# Altium project 转接板.PrjPCB
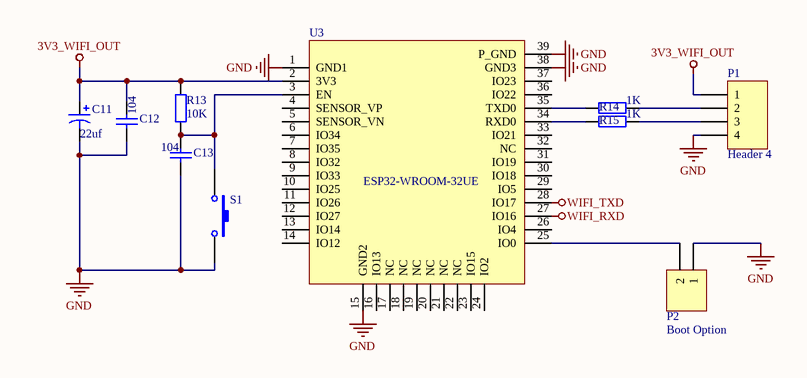
[diagram p0: 转接板.SchDoc]
1 sheet, 10 parts. Net scope: global (net labels, ports and power ports of the same name join across sheets).

## Sheet 转接板.SchDoc
size A0; Organization: Altium Limited; Address1: L3, 12a Rodborough Rd; Address2: Frenchs Forest; Address3: NSW; Address4: Australia 2086

### Parts
C11  value 22uf  [RB7.6-15]  (hidden comment: Cap Pol1)
C12  value 104  [0805-JT]  (hidden comment: Cap)
C13  value 104  [0805-JT]  (hidden comment: Cap)
P1  Header 4  [HDR1X4]
P2  Boot Option  [HDR1X2]
R13  value 10K  [0603-JT]  (hidden comment: Res2)
R14  value 1K  [0603-JT]  (hidden comment: Res2)
R15  value 1K  [0603-JT]  (hidden comment: Res2)
S1  SW-PB  [SPST-2]  (value not drawn)
U3  ESP32-WROOM-32UE  (value not drawn)

### Nets
3V3_WIFI_OUT: C11.1 C12.2 P1.1 R13.1 U3.2(3V3)
GND: C11.2 C12.1 C13.1 P1.4 P2.1 S1.2 U3.1(GND1) U3.15(GND2) U3.38(GND3) U3.39(P_GND)
WIFI_RXD: U3.27(IO16)
WIFI_TXD: U3.28(IO17)
NetC13_2: C13.2 R13.2 S1.1 U3.3(EN)
NetP1_2: P1.2 R14.2
NetP1_3: P1.3 R15.2
NetP2_2: P2.2 U3.25(IO0)
NetR14_1: R14.1 U3.35(TXD0)
NetR15_1: R15.1 U3.34(RXD0)

Not connected (* = marked no-connect by the designer): U3 4(SENSOR_VP) 5(SENSOR_VN) 6(IO34) 7(IO35) 8(IO32) 9(IO33) 10(IO25) 11(IO26) 12(IO27) 13(IO14) 14(IO12) 16(IO13) 17(NC) 18(NC) 19(NC) 20(NC) 21(NC) 22(NC) 23(IO15) 24(IO2) 26(IO4) 29(IO5) 30(IO18) 31(IO19) 32(NC) 33(IO21) 36(IO22) 37(IO23)

### Notes on the sheet
- Title
- Size:
- Date:
- File:
- A0
- Number:
- Time:
- Revision:
- Sheet
- of

### Library data of the parts
C11 = Cap Pol1: Polarized Capacitor (Radial); Published: 8-Jun-2000; LatestRevisionDate: 17-Jul-2002; LatestRevisionNote: Re-released for DXP Platform.; PackageReference: RB7.6-15; Publisher: Altium Limited; PackageDescription: Polarized Capacitor (Radial); 2 Leads
C12 C13 = Cap: Capacitor; Published: 8-Jun-2000; LatestRevisionDate: 17-Jul-2002; LatestRevisionNote: Re-released for DXP Platform.; PackageReference: RAD-0.3; Publisher: Altium Limited; PackageDescription: Radial Cap, Thru-Hole; 2 Leads; 0.3 in Pin Spacing
P1 = Header 4: Header, 4-Pin; LatestRevisionDate: 17-Jul-2002; LatestRevisionNote: Re-released for DXP Platform.; Publisher: Altium Limited
P2 = Header 2: Header, 2-Pin; LatestRevisionDate: 17-Jul-2002; LatestRevisionNote: Re-released for DXP Platform.; Publisher: Altium Limited
R13-R15 = Res2: Resistor; Published: 8-Jun-2000; LatestRevisionDate: 17-Jul-2002; LatestRevisionNote: Re-released for DXP Platform.; PackageReference: AXIAL-0.4; Publisher: Altium Limited; PackageDescription: Axial Device, Thru-Hole; 2 Leads; 0.4 in Pin Spacing
S1 = SW-PB: Switch; Published: 24-Mar-1999; LatestRevisionDate: 17-Jul-2002; LatestRevisionNote: Re-released for DXP Platform.; PackageReference: SPST-2; Publisher: Altium Limited; PackageDescription: Switch; 2 Leads
U3 = ESP32-WROOM-32UE: ESP32 wifi模块 IPEX接口天线